# EAGLE design untitled (EAGLE 6.1)
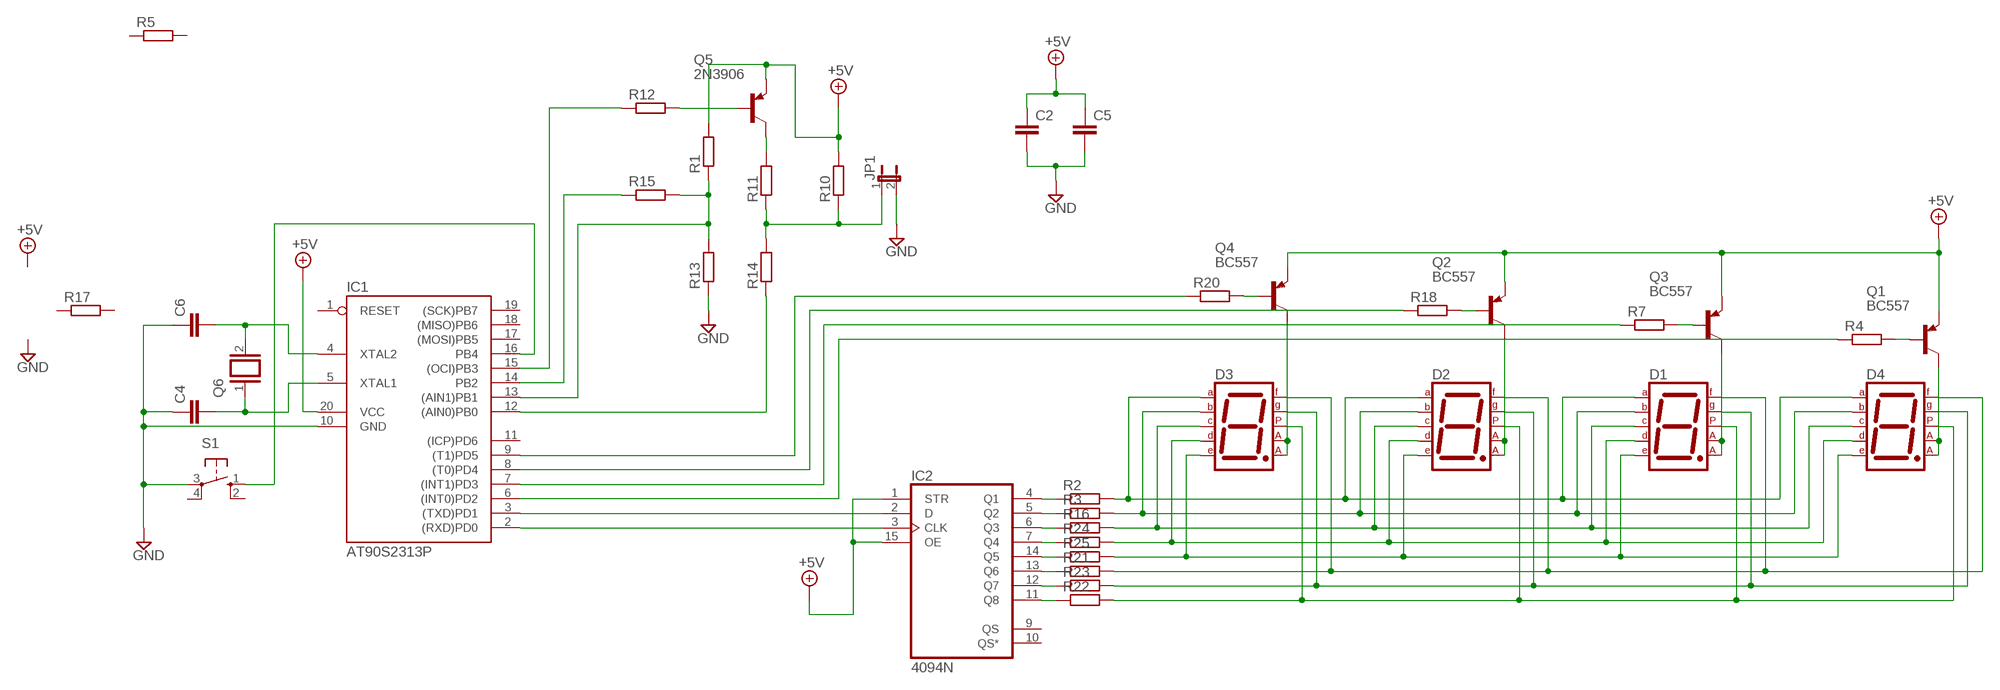
[diagram p0: schematic, sheet 1]

## Parts
C2  C-EU025-025X050  [C025-025X050]
C4  C-EU025-025X050  [C025-025X050]
C5  C-EU025-025X050  [C025-025X050]
C6  C-EU025-025X050  [C025-025X050]
D1  7SEG-CA  [7SEG-13]
D2  7SEG-CA  [7SEG-13]
D3  7SEG-CA  [7SEG-13]
D4  7SEG-CA  [7SEG-13]
IC1  AT90S2313P  [DIL20]
IC2  4094N  [DIL16]
JP1  JP1E  [JP1]
Q1  BC557  [TO92]
Q2  BC557  [TO92]
Q3  BC557  [TO92]
Q4  BC557  [TO92]
Q5  2N3906  [TO92]
Q6  XTAL/S  [QS]
R1  R-EU_0204/2V  [0204V]
R2  R-EU_0204/7  [0204/7]
R3  R-EU_0204/7  [0204/7]
R4  R-EU_0204/7  [0204/7]
R5  R-EU_0204/2V  [0204V]
R7  R-EU_0204/7  [0204/7]
R10  R-EU_0204/2V  [0204V]
R11  R-EU_0204/2V  [0204V]
R12  R-EU_0204/2V  [0204V]
R13  R-EU_0204/2V  [0204V]
R14  R-EU_0204/2V  [0204V]
R15  R-EU_0204/2V  [0204V]
R16  R-EU_0204/7  [0204/7]
R17  R-EU_0204/2V  [0204V]
R18  R-EU_0204/7  [0204/7]
R20  R-EU_0204/7  [0204/7]
R21  R-EU_0207/12  [0207/12]
R22  R-EU_0204/7  [0204/7]
R23  R-EU_0207/12  [0207/12]
R24  R-EU_0204/7  [0204/7]
R25  R-EU_0204/7  [0204/7]
S1  10-XX  [B3F-10XX]

## Nets
+5V: C2.1 C5.1 IC1.20(VCC) IC2.1(STR) IC2.15(OE) Q1.1(E) Q2.1(E) Q3.1(E) Q4.1(E) Q5.3(E) R1.2 R10.2
GND: C2.2 C4.1 C5.2 C6.1 IC1.10(GND) JP1.2 R13.1 S1.3(P)
N$2: Q1.2(B) R4.2
N$3: C4.2 IC1.5(XTAL1) Q6.1
N$4: C6.2 IC1.4(XTAL2) Q6.2
N$5: IC1.16(PB4) S1.1(S)
N$7: Q5.1(C) R11.2
N$8: JP1.1 R10.1 R11.1 R14.2
N$9: IC1.13((AIN1)PB1) R1.1 R13.2 R15.2
N$10: Q5.2(B) R12.2
N$11: IC1.15((OCI)PB3) R12.1
N$12: IC1.14(PB2) R15.1
N$13: IC1.12((AIN0)PB0) R14.1
N$14: IC1.3((TXD)PD1) IC2.2(D)
N$15: IC1.2((RXD)PD0) IC2.3(CLK)
N$16: D1.9(F) D2.9(F) D3.9(F) D4.9(F) R21.2
N$17: IC2.4(Q1) R2.1
N$18: IC2.5(Q2) R3.1
N$19: IC2.6(Q3) R16.1
N$20: IC2.7(Q4) R24.1
N$21: IC2.14(Q5) R25.1
N$22: IC2.13(Q6) R21.1
N$23: IC2.12(Q7) R23.1
N$24: IC2.11(Q8) R22.1
N$25: D1.7(A) D2.7(A) D3.7(A) D4.7(A) R2.2
N$26: D1.6(B) D2.6(B) D3.6(B) D4.6(B) R3.2
N$27: D1.4(C) D2.4(C) D3.4(C) D4.4(C) R16.2
N$28: D1.2(D) D2.2(D) D3.2(D) D4.2(D) R24.2
N$29: D1.1(E) D2.1(E) D3.1(E) D4.1(E) R25.2
N$30: D1.10(G) D2.10(G) D3.10(G) D4.10(G) R23.2
N$31: D1.5(DP) D2.5(DP) D3.5(DP) D4.5(DP) R22.2
N$32: D1.3(CA1) D1.8(CA2) Q3.3(C)
N$33: D2.3(CA1) D2.8(CA2) Q2.3(C)
N$34: D3.3(CA1) D3.8(CA2) Q4.3(C)
N$35: D4.3(CA1) D4.8(CA2) Q1.3(C)
N$36: Q3.2(B) R7.2
N$37: Q2.2(B) R18.2
N$38: Q4.2(B) R20.2
N$39: IC1.6((INT0)PD2) R4.1
N$40: IC1.7((INT1)PD3) R7.1
N$41: IC1.8((T0)PD4) R18.1
N$42: IC1.9((T1)PD5) R20.1
Unconnected: IC1.1(RESET) IC1.11((ICP)PD6) IC1.17((MOSI)PB5) IC1.18((MISO)PB6) IC1.19((SCK)PB7) IC2.9(QS) IC2.10(QS*) R5.1 R5.2 R17.1 R17.2 S1.2(S1) S1.4(P1)

## Power pins joined to a net without a drawn wire
VDD: IC2.16(VDD)
VSS: IC2.8(VSS)

## Library data of the parts
C2 C4-C6 = rcl:C-EU: CAPACITOR, European symbol
D1-D4 = special:7SEG-CA: 7-segment DISPLAY single anode, 13 mm
IC1 = atmel:AT90S2313: MICROCONTROLLER 2 Kbytes FLASH 128 bytes SRAM 128 bytes EEPROM UART; OC_FARNELL: unknown; OC_NEWARK: unknown
IC2 = 40xx:4094: 8-stage SHIFT/STORE REGISTER, tri-state
JP1 = jumper:JP1E: JUMPER
Q1-Q4 = transistor-pnp:BC557: PNP Transistor
Q5 = transistor-pnp:2N3906: PNP Transistor
Q6 = special:XTAL/S: CRYSTAL
R1-R5 R7 R10-R18 R20-R25 = rcl:R-EU_: RESISTOR, European symbol
S1 = switch-omron:10-XX: OMRON SWITCH; MPN: B3F-1000; OC_FARNELL: 176432; OC_NEWARK: 36M3542

## Board
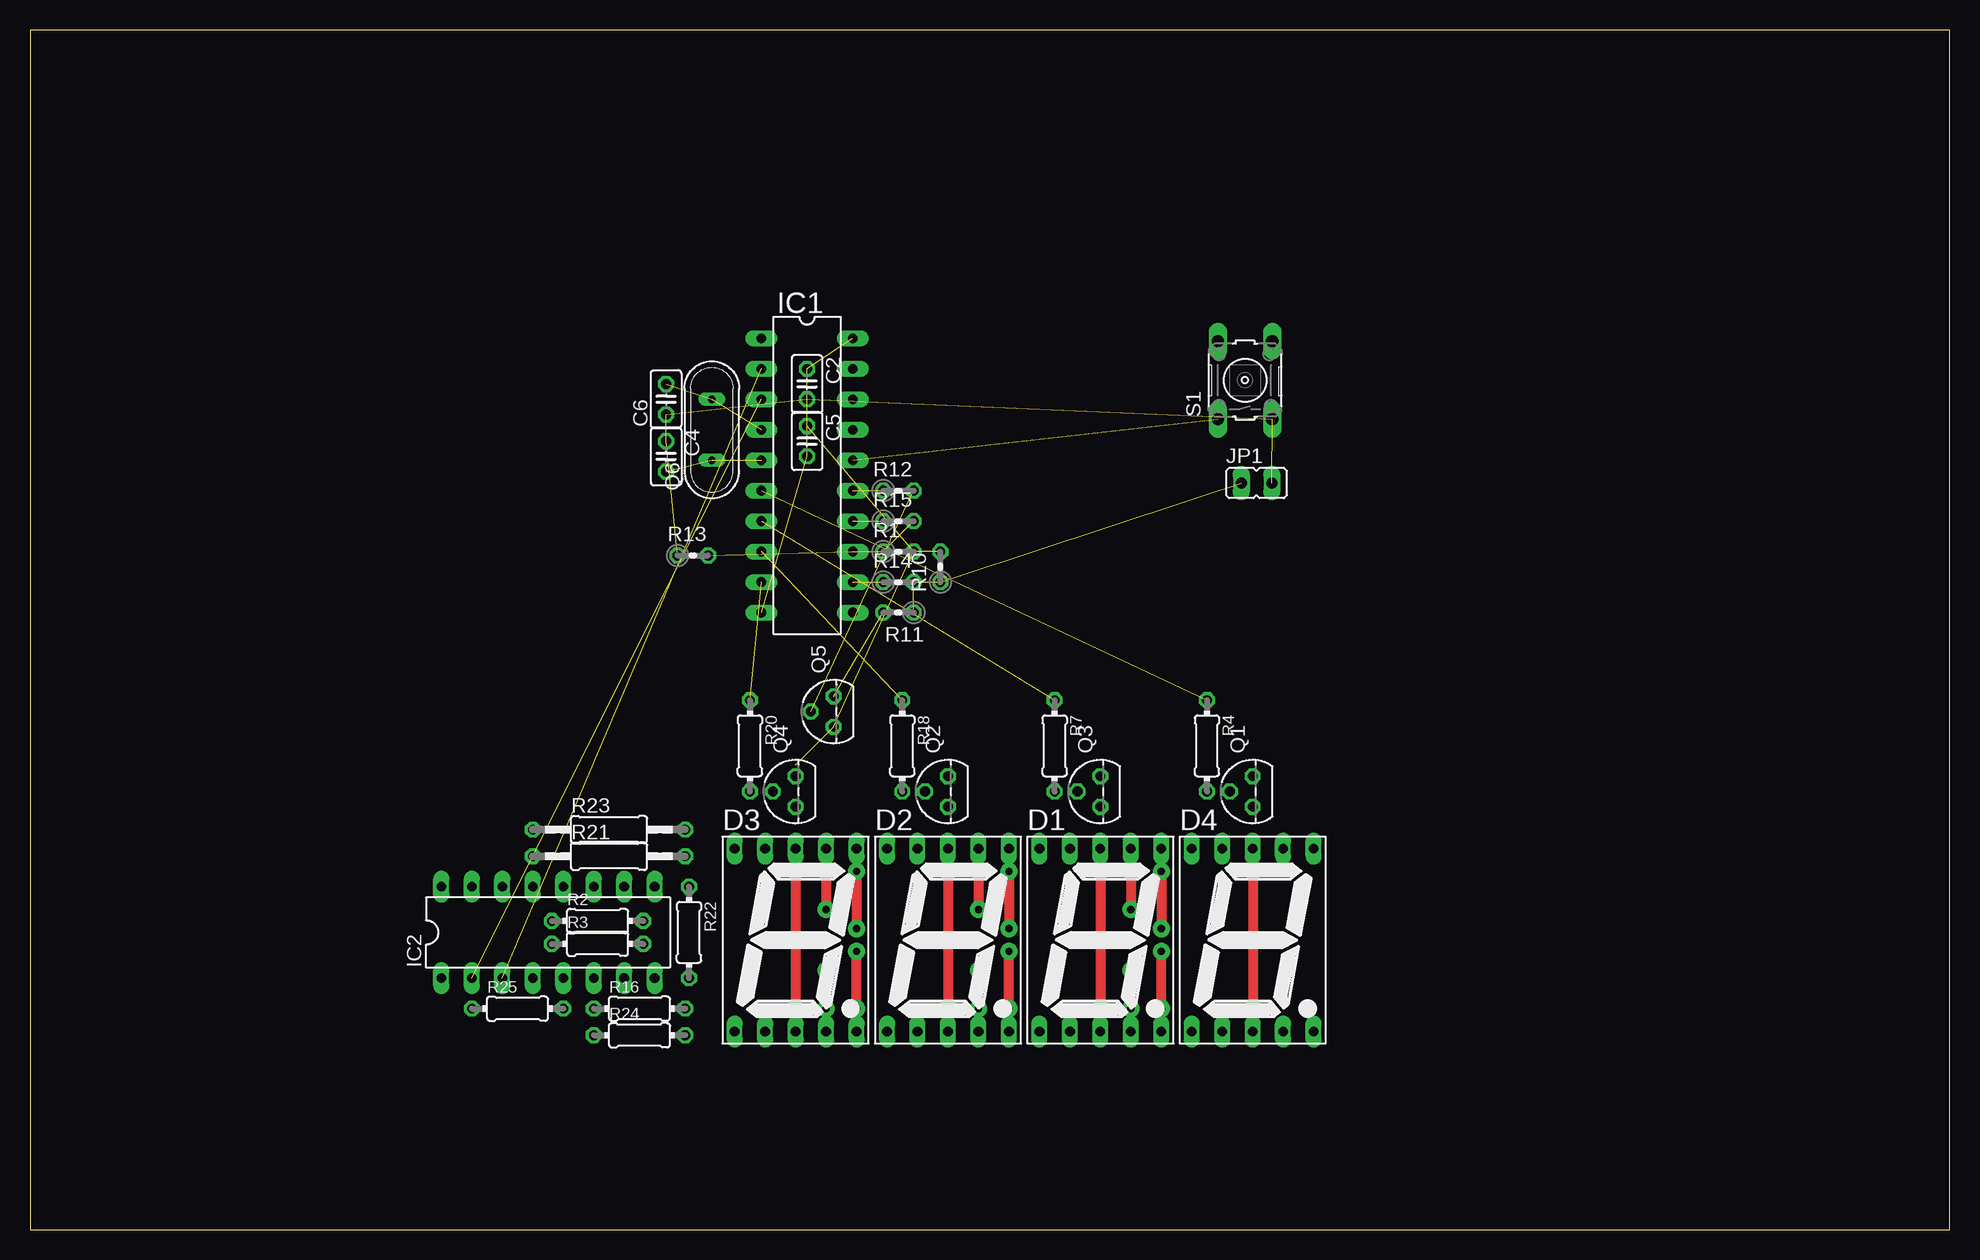
[diagram p1: board, top side]
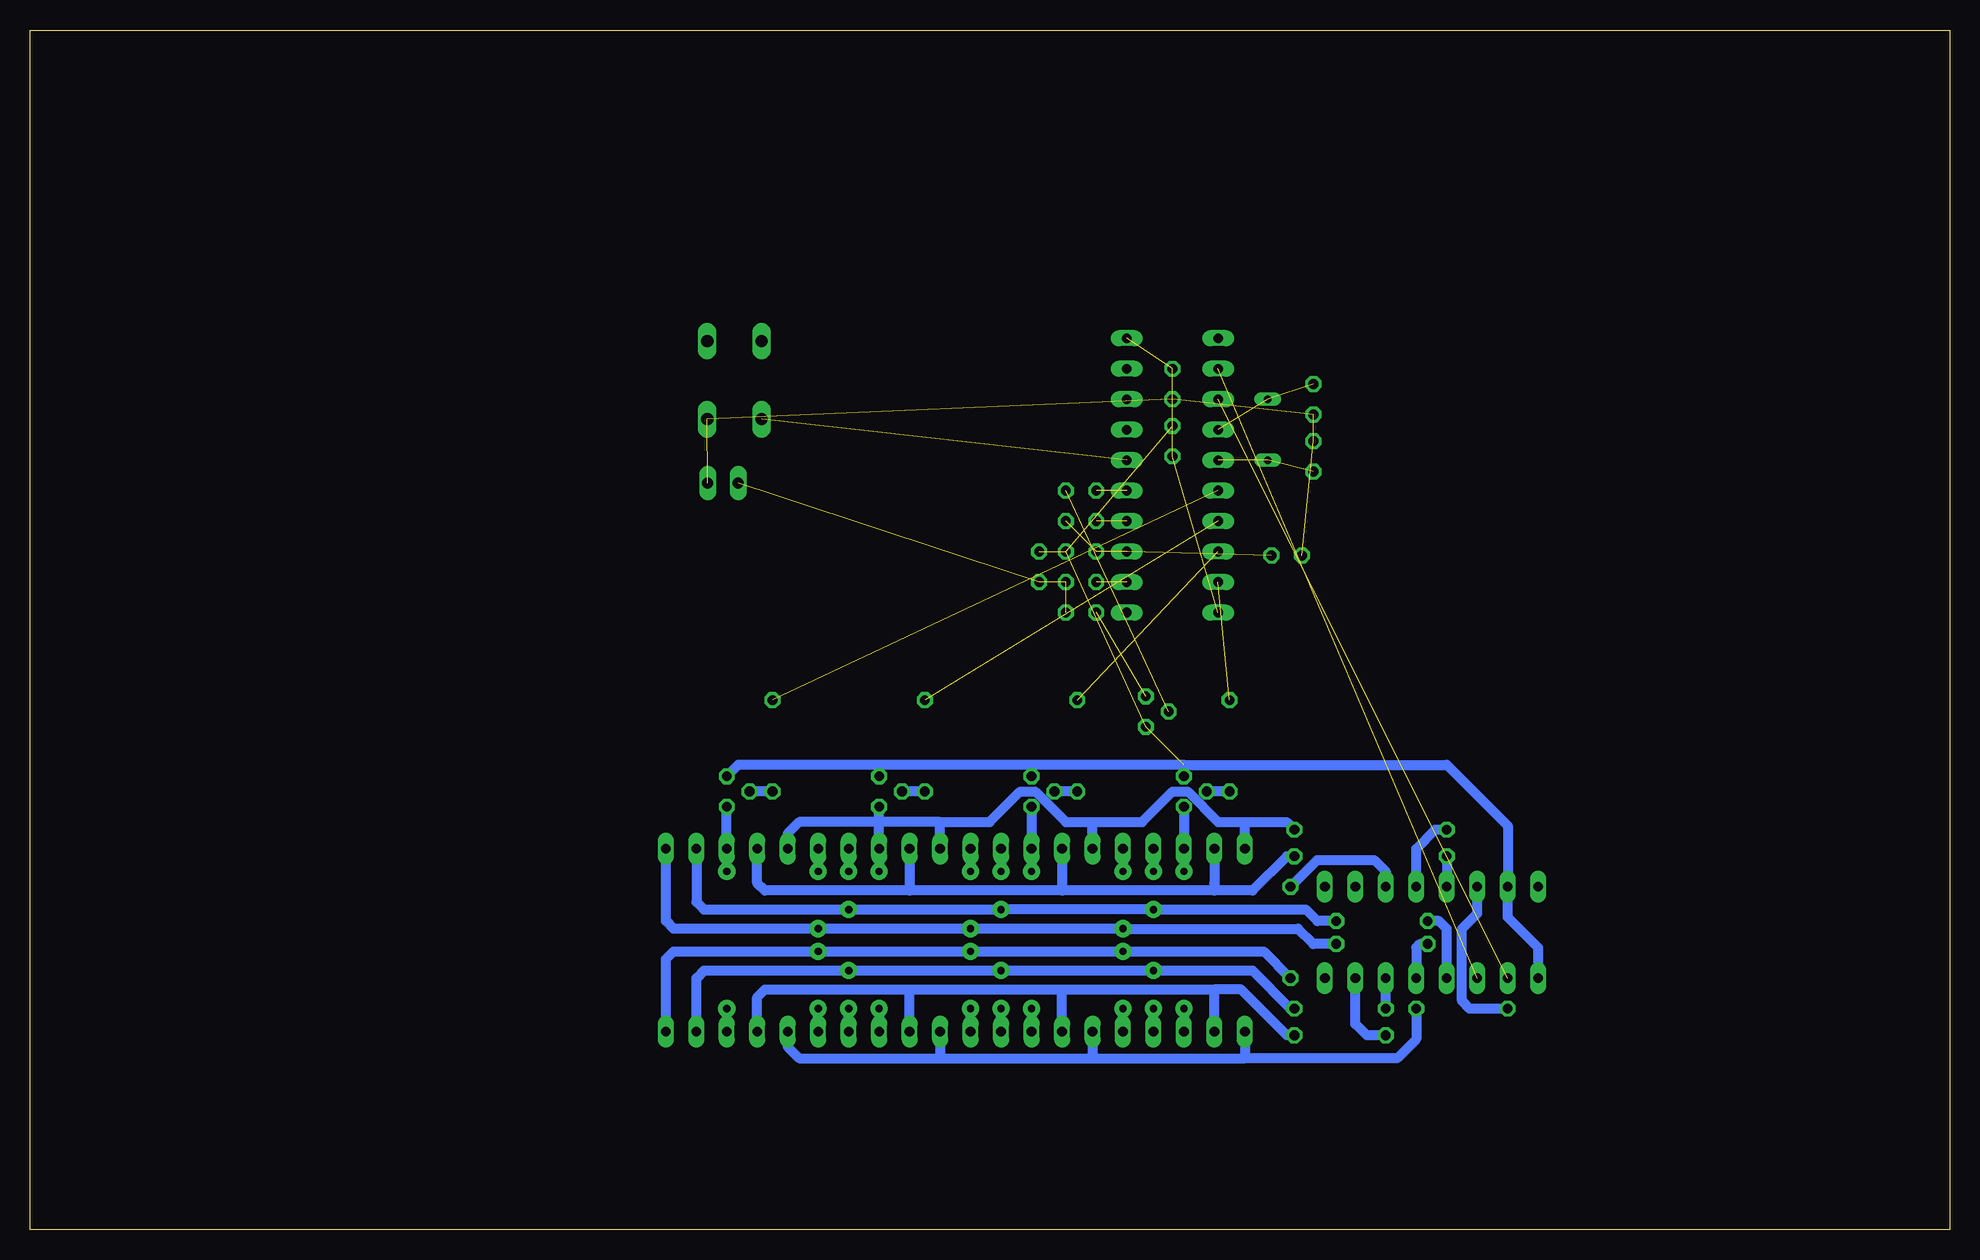
[diagram p2: board, bottom side, seen from below]

Size 160 x 100 mm. Coordinates in mm from the lower left corner, seen from the top.
Outline: 0,0 160,0 160,100 0,100 0,0
Copper layers (1*16): Top 0.035mm / dielectric 1.5mm / Bottom 0.035mm
Design rules: minimum track width 10mil, minimum drill 24mil, track to track 8mil, track to pad 8mil, pad to pad 8mil, via to via 8mil, smd to smd 8mil, copper to edge 40mil, drill to drill 8mil, minimum pad ring 10mil, minimum via ring 8mil, stop-mask expansion 4mil, vias tented up to drill 0mil, thermal gap 10mil

### Footprints (pad centres in the part's own frame; a part is rotated, then mirrored left to right if it is on the bottom)
C025-025X050 = drill 0.813 octagon: 1 -1.27,0; 2 1.27,0
7SEG-13 = drill 0.813 long: 1 -5.08,-7.62; 2 -2.54,-7.62; 3 0,-7.62; 4 2.54,-7.62; 5 5.08,-7.62; 6 5.08,7.62; 7 2.54,7.62; 8 0,7.62; 9 -2.54,7.62; 10 -5.08,7.62
DIL20 = drill 0.813 long: 1 -11.43,-3.81; 2 -8.89,-3.81; 3 -6.35,-3.81; 4 -3.81,-3.81; 5 -1.27,-3.81; 6 1.27,-3.81; 7 3.81,-3.81; 8 6.35,-3.81; 9 8.89,-3.81; 10 11.43,-3.81; 11 11.43,3.81; 12 8.89,3.81; 13 6.35,3.81; 14 3.81,3.81; 15 1.27,3.81; 16 -1.27,3.81; 17 -3.81,3.81; 18 -6.35,3.81; 19 -8.89,3.81; 20 -11.43,3.81
DIL16 = drill 0.813 long: 1 -8.89,-3.81; 2 -6.35,-3.81; 3 -3.81,-3.81; 4 -1.27,-3.81; 5 1.27,-3.81; 6 3.81,-3.81; 7 6.35,-3.81; 8 8.89,-3.81; 9 8.89,3.81; 10 6.35,3.81; 11 3.81,3.81; 12 1.27,3.81; 13 -1.27,3.81; 14 -3.81,3.81; 15 -6.35,3.81; 16 -8.89,3.81
JP1 = drill 0.914 long: 1 0,-1.27; 2 0,1.27
TO92 = drill 0.813 octagon: 1 1.27,0; 2 0,1.905; 3 -1.27,0
QS = drill 0.61 long: 1 -2.54,0; 2 2.54,0
0204V = drill 0.813 octagon: 1 -1.27,0; 2 1.27,0
0204/7 = drill 0.813 octagon: 1 -3.81,0; 2 3.81,0
0207/12 = drill 0.813 octagon: 1 -6.35,0; 2 6.35,0
B3F-10XX = drill 1.016 long: 1 -3.251,2.261; 2 3.251,2.261; 3 -3.251,-2.261; 4 3.251,-2.261

### Placement (x,y rotation side)
C2  64.77,70.48 270 top
C4  53.02,64.45 270 top
C5  64.77,65.72 270 top
C6  53.02,69.22 90 top
D1  89.22,24.13 0 top
D2  76.52,24.13 0 top
D3  63.82,24.13 0 top
D4  101.92,24.13 0 top
IC1  64.77,62.87 270 top
IC2  43.18,24.77 0 top
JP1  102.23,62.23 270 top
Q1  101.92,36.51 90 top
Q2  76.52,36.51 90 top
Q3  89.22,36.51 90 top
Q4  63.82,36.51 90 top
Q5  66.99,43.18 90 top
Q6  56.83,66.67 90 top
R1  72.39,56.52 0 top
R2  47.31,25.72 0 top
R3  47.31,23.81 0 top
R4  98.11,40.32 270 top
R5  -36.83,25.4 0 top  (outside the outline)
R7  85.41,40.32 270 top
R10  75.88,55.24 90 top
R11  72.39,51.44 180 top
R12  72.39,61.59 0 top
R13  55.24,56.2 0 top
R14  72.39,53.98 0 top
R15  72.39,59.05 0 top
R16  50.8,18.41 0 top
R17  -15.24,37.15 0 top  (outside the outline)
R18  72.71,40.32 270 top
R20  60.01,40.32 270 top
R21  48.26,31.11 0 top
R22  54.93,24.77 270 top
R23  48.26,33.34 0 top
R24  50.8,16.19 0 top
R25  40.64,18.41 0 top
S1  101.28,70.8 90 top

### Tracks (layer width: path | path; a pad name or v marks a point on that pad's centre or on a via)
+5V  (6 unrouted)
  Bottom 0.813: 63.82,38.73 76.52,38.73 | 76.52,38.73 89.22,38.73 | 89.22,38.73 100.97,38.73 Q1.1 | Q3.1 89.22,38.73 | Q2.1 76.52,38.73 | Q4.1 63.82,38.73 | 63.82,38.73 41.91,38.73 36.83,33.66 IC2.15 36.83,26.04 34.29,23.5 IC2.1
GND  (7 unrouted)
N$2
  Bottom 0.813: R4.2 Q1.2
N$3  (2 unrouted)
N$4  (2 unrouted)
N$5  (1 unrouted)
N$7  (1 unrouted)
N$8  (3 unrouted)
N$9  (3 unrouted)
N$10  (1 unrouted)
N$11  (1 unrouted)
N$12  (1 unrouted)
N$13  (1 unrouted)
N$14  (1 unrouted)
N$15  (1 unrouted)
N$16
  Bottom 0.813: 61.28,28.89 D3.9 61.28,28.26 | 61.28,28.26 73.98,28.26 | D2.9 73.98,28.26 | 73.98,28.26 86.68,28.26 | 86.68,28.26 98.74,28.26 99.38,28.89 D4.9 | D1.9 86.68,28.26 | 61.28,28.26 58.1,28.26 55.24,31.11 R21.2
N$17
  Bottom 0.813: IC2.4 41.91,25.08 42.55,25.72 R2.1
N$18
  Bottom 0.813: R3.1 44.13,23.81 44.45,23.5 IC2.5
N$19
  Bottom 0.813: R16.1 IC2.6
N$20
  Bottom 0.813: R24.1 48.58,16.19 49.53,17.14 IC2.7
N$21
  Bottom 0.813: R25.1 40.01,18.41 40.64,19.05 40.64,25.08 39.37,26.35 IC2.14
N$22
  Bottom 0.813: R21.1 IC2.13
N$23
  Bottom 0.813: IC2.12 44.45,31.75 42.86,33.34 R23.1
N$24
  Bottom 0.813: R22.1 52.7,30.8 47.94,30.8 46.99,29.84 IC2.11
N$25  (via drill 0.6 pad 1.42)
  Top 0.813: v66.36,29.84 v66.36,26.67 | v79.06,29.84 v79.06,26.67 | v91.76,29.84 v91.76,26.67
  Bottom 0.813: D3.7 v66.36,29.84 | D2.7 v79.06,29.84 | D1.7 v91.76,29.84 | D4.7 104.46,27.3 103.82,26.67 v91.76,26.67 v79.06,26.67 v66.36,26.67 53.66,26.67 52.7,25.72 R2.2
N$26  (via drill 0.6 pad 1.42)
  Top 0.813: v68.9,29.84 v68.9,25.08 | v81.6,29.84 v81.6,25.08 | v94.3,29.84 v94.3,25.08
  Bottom 0.813: D3.6 v68.9,29.84 | D2.6 v81.6,29.84 | 93.98,25.08 v81.6,25.08 v68.9,25.08 54.29,25.08 53.02,23.81 R3.2 | 93.98,25.08 v94.3,25.08 | v94.3,25.08 106.36,25.08 107,25.72 D4.6 | D1.6 v94.3,29.84 | v94.3,25.08 94.3,24.77 93.98,25.08
N$27  (via drill 0.6 pad 1.42)
  Top 0.813: v91.76,18.41 v91.76,21.59 | v79.06,18.41 v79.06,21.59 | v66.36,18.41 v66.36,21.59
  Bottom 0.813: D4.4 104.46,20.95 103.82,21.59 v91.76,21.59 v79.06,21.59 v66.36,21.59 58.1,21.59 54.93,18.41 R16.2 | D1.4 v91.76,18.41 | D2.4 v79.06,18.41 | D3.4 v66.36,18.41
N$28
  Bottom 0.813: D4.2 99.38,19.37 98.74,20 86.68,20 | 86.68,20 73.98,20 | 73.98,20 61.28,20 | D1.2 86.68,20 | D2.2 73.98,20 | D3.2 61.28,20 | R24.2 55.24,16.19 59.05,20 61.28,20
N$29
  Bottom 0.813: D4.1 96.84,15.24 95.89,14.29 84.14,14.29 | 84.14,14.29 71.44,14.29 | 71.44,14.29 58.74,14.29 | D3.1 58.74,14.29 | D2.1 71.44,14.29 | D1.1 84.14,14.29 | 58.74,14.29 46.04,14.29 44.45,15.88 R25.2
N$30
  Bottom 0.813: D3.10 58.74,33.97 | D2.10 71.44,33.97 | 84.14,33.97 95.89,33.97 96.84,33.02 D4.10 | D1.10 84.14,33.97 | 58.74,33.97 55.24,33.97 R23.2 | 84.14,33.97 80.01,33.97 77.47,36.51 76.2,36.51 73.66,33.97 71.44,33.97 | 71.44,33.97 67.31,33.97 64.77,36.51 63.5,36.51 60.96,33.97 58.74,33.97
N$31  (via drill 0.6 pad 1.42)
  Top 0.813: v94.3,18.41 v94.3,23.18 | v81.6,18.41 v81.6,23.18 | v68.9,18.41 v68.9,23.18
  Bottom 0.813: D4.5 107,22.54 106.36,23.18 v94.3,23.18 v81.6,23.18 v68.9,23.18 57.15,23.18 R22.2 | D1.5 v94.3,18.41 | D2.5 v81.6,18.41 | D3.5 v68.9,18.41
N$32  (via drill 0.6 pad 1.42)
  Top 0.813: v89.22,29.84 v89.22,18.41
  Bottom 0.813: Q3.3 D1.8 v89.22,29.84 | v89.22,18.41 D1.3
N$33  (via drill 0.6 pad 1.42)
  Top 0.813: v76.52,29.84 v76.52,18.41
  Bottom 0.813: v76.52,29.84 D2.8 Q2.3 | v76.52,18.41 D2.3
N$34  (via drill 0.6 pad 1.42)
  Top 0.813: v63.82,29.84 v63.82,18.41
  Bottom 0.813: v63.82,29.84 D3.8 Q4.3 | v63.82,18.41 D3.3
N$35  (via drill 0.6 pad 1.42)
  Top 0.813: v101.92,29.84 v101.92,18.41
  Bottom 0.813: v101.92,29.84 D4.8 Q1.3 | v101.92,18.41 D4.3
N$36
  Bottom 0.813: R7.2 Q3.2
N$37
  Bottom 0.813: R18.2 Q2.2
N$38
  Bottom 0.813: R20.2 Q4.2
N$39  (1 unrouted)
N$40  (1 unrouted)
N$41  (1 unrouted)
N$42  (1 unrouted)